# Altium project VENTUNOQ.PrjPcb (part 1 of 18)
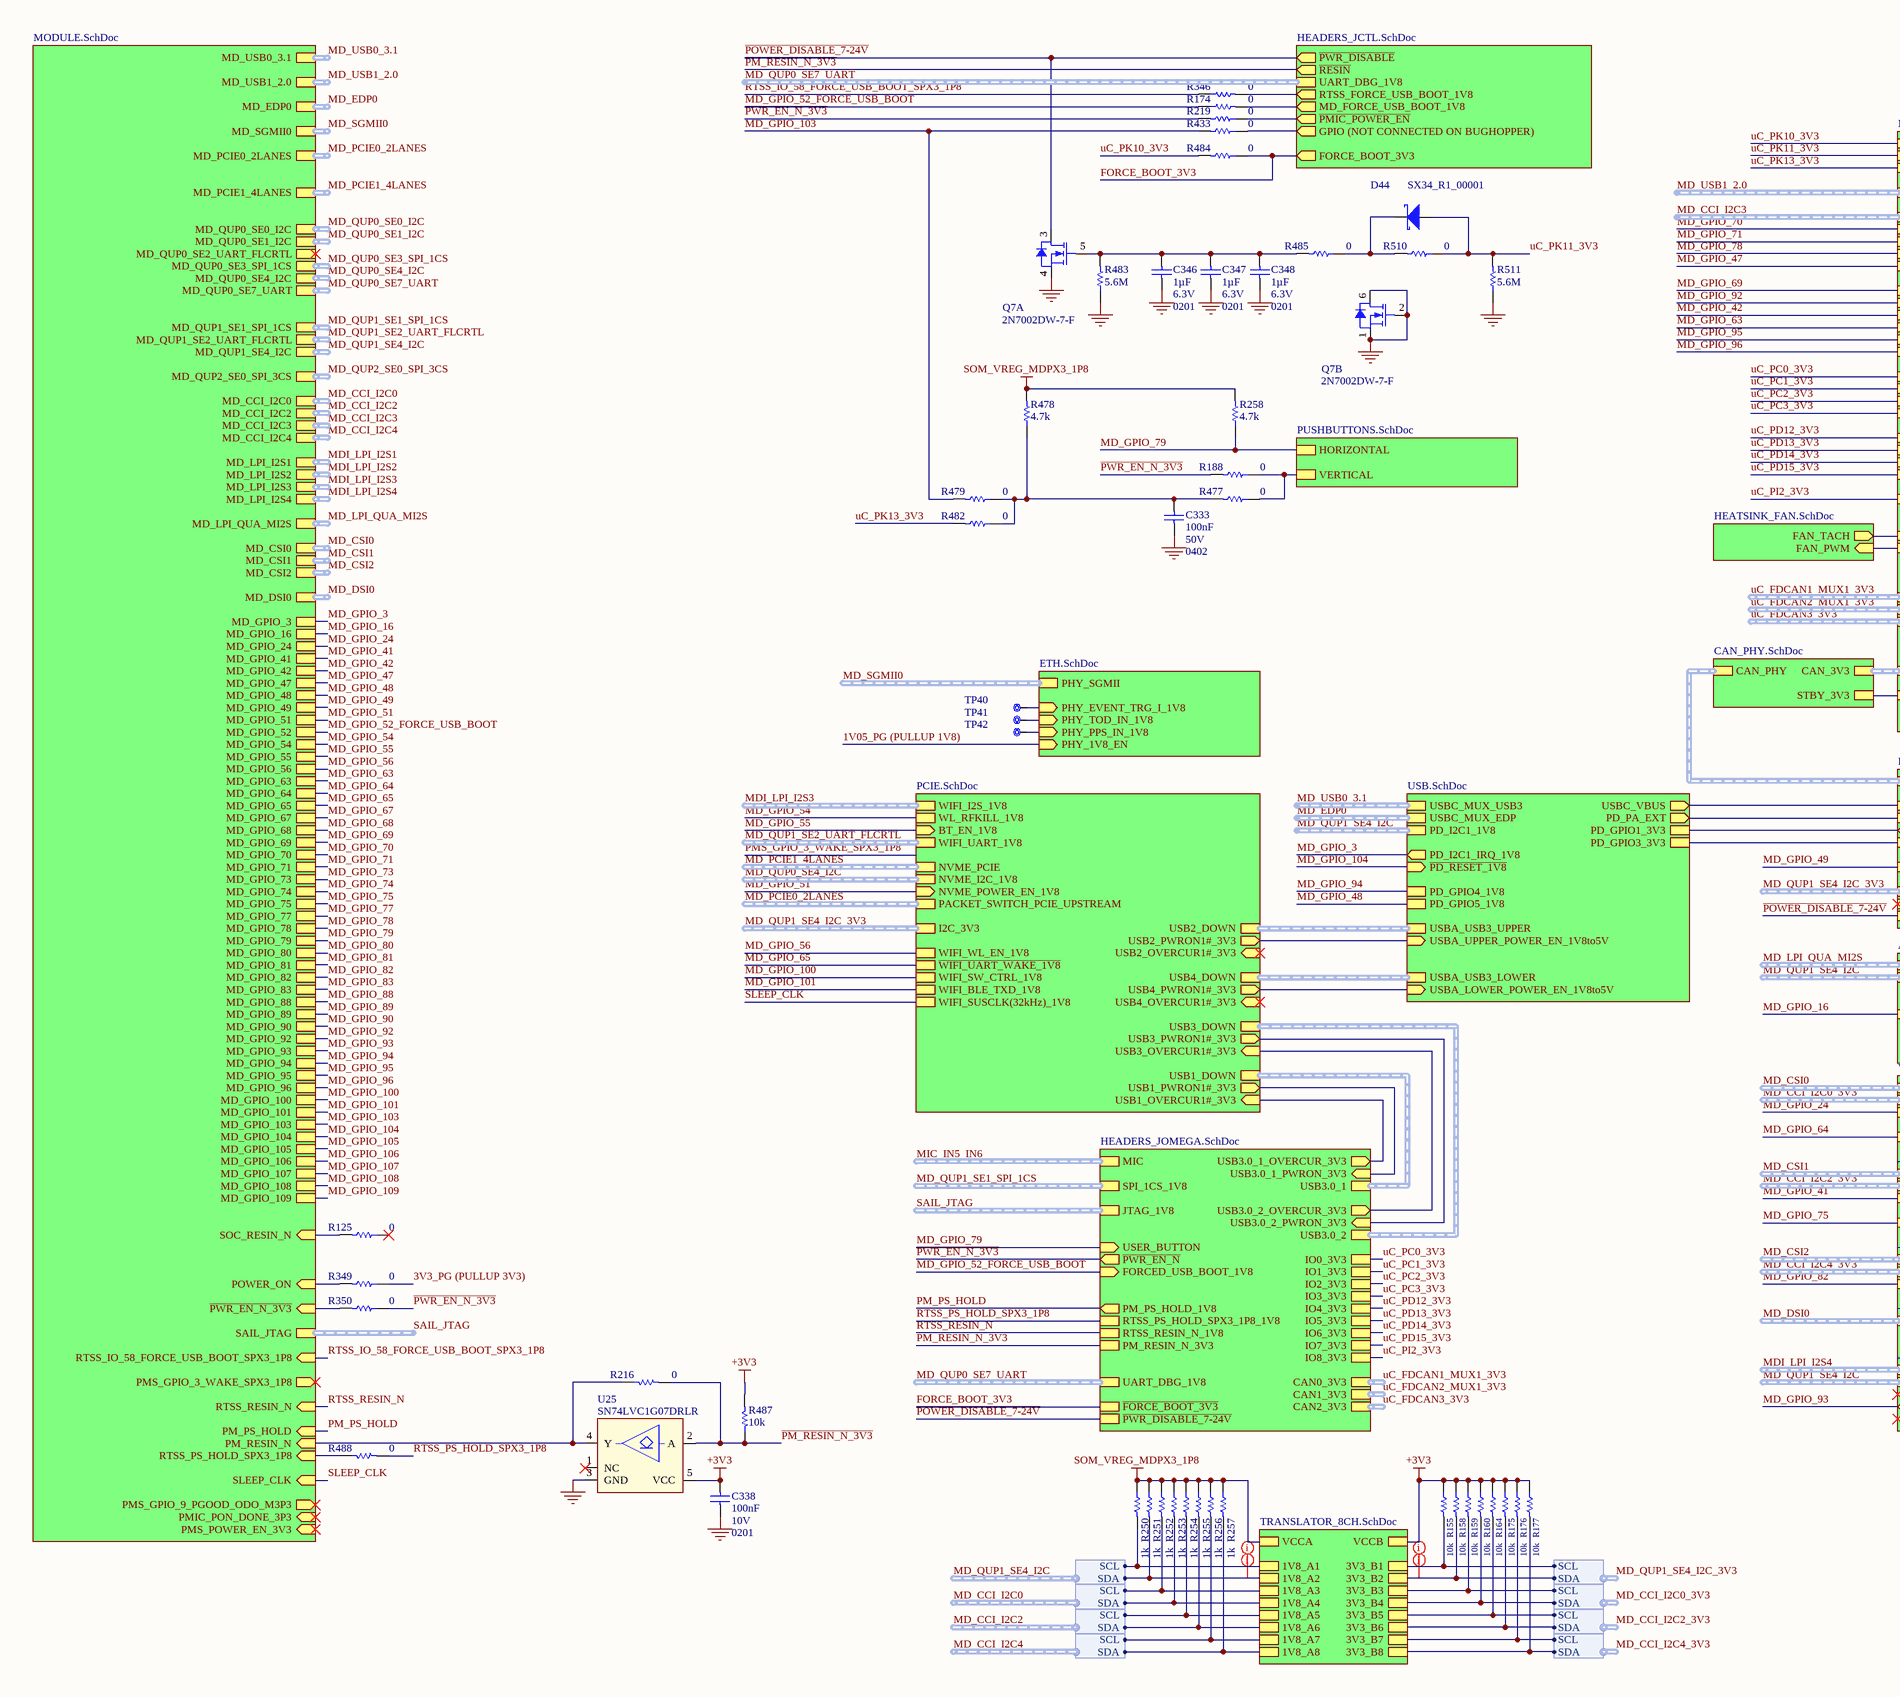
[diagram p0: TOP.SchDoc, left]
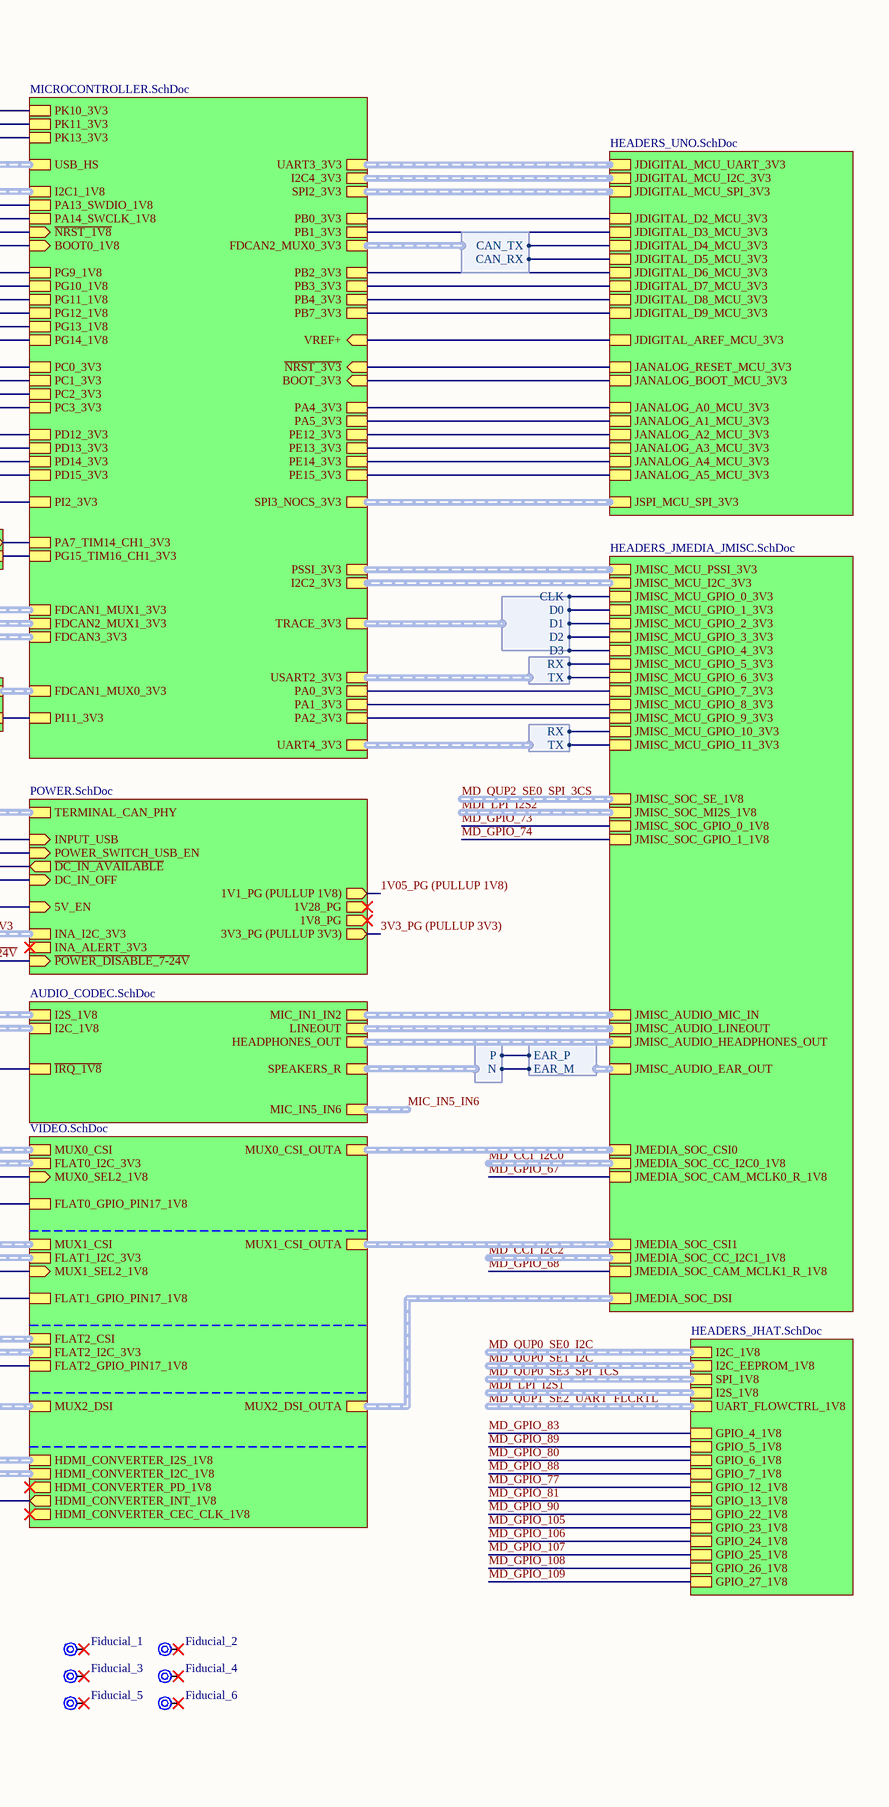
[diagram p1: TOP.SchDoc, right]
ASSEMBLY_BGA: X; ASSEMBLY_PRESSFIT: _; ASSEMBLY_SMD: X; ASSEMBLY_THT: X; BOARD_CODENAME: GERTRUDE; BOARD_INFO_AUTHOR: Silvio Navaretti; BOARD_INFO_AUTHOR_REV: Silvio Navaretti; BOARD_INFO_Er: _; BOARD_INFO_FLEX: _; BOARD_INFO_FR4: X; BOARD_INFO_FR4_HTG: _; BOARD_INFO_IPC1: _; BOARD_INFO_IPC2: X; BOARD_INFO_IPC3: _; BOARD_INFO_IPC_NA: X; BOARD_INFO_NUMBER_OF_LAYERS: 10; BOARD_INFO_PCB_SIZE: 100x160mm; BOARD_INFO_POLYMIDE: _; BOARD_INFO_RIGID: X; BOARD_INFO_RIGID/FLEX: _; BOARD_INFO_TBD: _; BOARD_INFO_THICKNESS: 2mm; DRILLS_BLIND: X; DRILLS_BURIED: X; DRILLS_COPPER_FILLING: X; DRILLS_FULL: X; DRILLS_LASER: X; DRILLS_PRESSFIT: _; DRILLS_RESIN_FILLING: _; DRILLS_SLOT: X; DRILLS_SOLDER_FILLING: _; FINISH_ADJUSTMENTS: _; FINISH_EDGE_PLATING: _; FINISH_ENIG: X; FINISH_HAL: _; FINISH_HAL_LF: _; FINISH_NI/AU: _; FINISH_SILK_BOTTOM: X; FINISH_SILK_COLOR: WHITE; FINISH_SILK_TOP: X; FINISH_SN/PB: _; FINISH_SOLDERMASK_BOTTOM: X; FINISH_SOLDERMASK_COLOR: BLUE; FINISH_SOLDERMASK_PEELABLE_BOTTOM: _; FINISH_SOLDERMASK_PEELABLE_COLOR: _; FINISH_SOLDERMASK_PEELABLE_TOP: _; FINISH_SOLDERMASK_TOP: X; FINISH_TABS: _; FINISH_TBD: _; INSULATION_MIN_INNER: 0.084mm; INSULATION_MIN_OUTER: 0.084mm; PANEL_MILLING: X; PANEL_NOT_REQUESTED: _; PANEL_NUMBER_OF_FIGURES: _; PANEL_PROVIDED: _; PANEL_REQUESTED: X; PANEL_SCORING: X; PANEL_SIZE: _; PANEL_TABS: _; SKU: ABX00181; TRACK_MIN_WIDTH_INNER: 0.084mm; TRACK_MIN_WIDTH_OUTER: 0.084mm; Version: V1.0; VIA_1: X; VIA_1_HOLE_MM: 0.1; VIA_1_PAD_MM: 0.25; VIA_2: 0.2; VIA_2_HOLE_MM: 0.4; VIA_2_PAD_MM: _; VIA_3: _; VIA_3_HOLE_MM: _; VIA_3_PAD_MM: _; VIA_4: _; VIA_4_HOLE_MM: _; VIA_4_PAD_MM: _; VIA_5: _; VIA_5_HOLE_MM: _; VIA_5_PAD_MM: _; VIA_THROUGH: X; VIA_THROUGH_HOLE_MM: 0.3; VIA_THROUGH_PAD_MM: 0.6
51 sheets, 1358 parts. Net scope: hierarchical (ports join the sheet entries above them; power ports are global).
Board file: PCB.PcbDoc
Sheets:
  TOP.SchDoc
    MODULE = MODULE.SchDoc
      MODULE_GND = MODULE_GND.SchDoc
      MODULE_PWR = MODULE_PWR.SchDoc
      MODULE_SAIL = MODULE_SAIL.SchDoc
      U_SOM_MD = MODULE_MD.SchDoc
      MODULE_SAIL_FLASH = MODULE_SAIL_FLASH.SchDoc
      MODULE_STRAPS_MD = MODULE_STRAPS_MD.SchDoc
      MODULE_STRAPS_SAIL = MODULE_STRAPS_SAIL.SchDoc
      MODULE_CONTROL = MODULE_CONTROL.SchDoc
    U_USB = USB.SchDoc
      U_USB_USBC = USB_USBC.SchDoc
      U_USB_MUX = USB_MUX.SchDoc
      U_USB_PD_CONTROLLER = USB_PD_CONTROLLER.SchDoc
        T8CH_ = TRANSLATOR_8CH.SchDoc
      U_USB_USBA = USB_USBA.SchDoc
      U_LOAD_SWITCH_5V = LOAD_SWITCH_5V.SchDoc
      U_LOAD_SWITCH_5V = LOAD_SWITCH_5V.SchDoc
    U_ETH = ETH.SchDoc
      U_ETH_PHY = ETH_PHY.SchDoc
        U_LOAD_SWITCH_5V = LOAD_SWITCH_5V.SchDoc
      U_ETH_RJ45 = ETH_RJ45.SchDoc
    U_HEADERS_UNO = HEADERS_UNO.SchDoc
    U_POWER = POWER.SchDoc
      U_POWER_SOM = POWER_DCDC_SOM.SchDoc
      U_POWER_DCDC_CARRIER = POWER_REGULATORS_CARRIER.SchDoc
      U_LOAD_SWITCH_5V = LOAD_SWITCH_5V.SchDoc
      U_LOAD_SWITCH_5V = LOAD_SWITCH_5V.SchDoc
    U_AUDIO_CODEC = AUDIO_CODEC.SchDoc
    U_HEADERS_JHAT = HEADERS_JHAT.SchDoc
      T8CH_ = TRANSLATOR_8CH.SchDoc
      T8CH_ = TRANSLATOR_8CH.SchDoc
      T8CH_ = TRANSLATOR_8CH.SchDoc
      U_TRANSLATOR_4CH = TRANSLATOR_4CH.SchDoc
    U_MIPI = VIDEO.SchDoc
      U_HDMI = HDMI.SchDoc
        U_HDMI_CONNECTOR = HDMI_CONNECTOR.SchDoc
        U_HDMI_CONVERTER = HDMI_CONVERTER.SchDoc
      U_MIPI_MUX = MIPI_MUX.SchDoc
      U_MIPI_MUX = MIPI_MUX.SchDoc
      U_MIPI_FLAT_22PIN = MIPI_FLAT_22PIN.SchDoc
      U_MIPI_FLAT_22PIN = MIPI_FLAT_22PIN.SchDoc
      U_MIPI_MUX = MIPI_MUX.SchDoc
      U_MIPI_FLAT_22PIN = MIPI_FLAT_22PIN.SchDoc
      U_TRANSLATOR_4CH = TRANSLATOR_4CH.SchDoc
    U_PUSHBUTTONS = PUSHBUTTONS.SchDoc
    U_HEADERS_JALFA_JBETA = HEADERS_JOMEGA.SchDoc
    U_MICROCONTROLLER = MICROCONTROLLER.SchDoc
      U_STM32 = STM32.SchDoc
      U_LED = LED.SchDoc
        U_LED_MATRIX = LED_MATRIX.SchDoc
        U_LED_RGB = LED_RGB.SchDoc
        U_LED_RGB = LED_RGB.SchDoc
        U_LED_RGB = LED_RGB.SchDoc
        U_LED_RGB = LED_RGB.SchDoc
      U_QWIIC = QWIIC.SchDoc
      U_ANALOG_SWITCH = ANALOG_SWITCH.SchDoc
      U_TRANSLATOR_4CH = TRANSLATOR_4CH.SchDoc
    U_HEADERS_JMEDIA_JMISC = HEADERS_JMEDIA_JMISC.SchDoc
    U_HEADERS_JCTL = HEADERS_JCTL.SchDoc
    T8CH_ = TRANSLATOR_8CH.SchDoc
    U_HEATSINK_FAN = HEATSINK_FAN.SchDoc
    U_PCIE = PCIE.SchDoc
      U_PCIE_PACKET_SWITCH = PCIE_PACKET_SWITCH.SchDoc
      U_PCIE_NVME = PCIE_NVME.SchDoc
        U_LOAD_SWITCH_5V = LOAD_SWITCH_5V.SchDoc
      U_WIFI_BLE = WIFI_BLE.SchDoc
        U_TRANSLATOR_4CH = TRANSLATOR_4CH.SchDoc
      U_PCIE_USB = PCIE_USB.SchDoc
      U_TRANSLATOR_4CH = TRANSLATOR_4CH.SchDoc
    U_CAN_PHY = CAN_PHY.SchDoc

## Sheet TOP.SchDoc: TOP
size A2; Author: Silvio Navaretti; CompanyName: ARDUINO; DrawnBy: Silvio Navaretti; Engineer: Silvio Navaretti; Organization: ARDUINO; SheetNumber: 1; SheetTotal: 51; RevAuthor: Silvio Navaretti

### Parts
C333  value 100nF  Voltage: 50V  Case Code (Imperial): 0402  [CAP-0402]  (hidden comment: GRM155R61H104KE19D)
C338  value 100nF  Voltage: 10V  Case Code (Imperial): 0201  [CAP-0201]  (hidden comment: CL03A104KP3NNNC)
C346  value 1µF  Voltage: 6.3V  Case Code (Imperial): 0201  [CAP-0201]  (hidden comment: GRM033R60J105MEA2D)
C347  value 1µF  Voltage: 6.3V  Case Code (Imperial): 0201  [CAP-0201]  (hidden comment: GRM033R60J105MEA2D)
C348  value 1µF  Voltage: 6.3V  Case Code (Imperial): 0201  [CAP-0201]  (hidden comment: GRM033R60J105MEA2D)
D44  SX34_R1_00001  [SMA DO214AC]
Fiducial_1  Fiducial mark 1mm with 2mm solder  [Fiducial mark 1mm with circle-Footprint-1]  (value not drawn)  (no BOM)
Fiducial_2  Fiducial mark 1mm with 2mm solder  [Fiducial mark 1mm with circle-Footprint-1]  (value not drawn)  (no BOM)
Fiducial_3  Fiducial mark 1mm with 2mm solder  [Fiducial mark 1mm with circle-Footprint-1]  (value not drawn)  (no BOM)
Fiducial_4  Fiducial mark 1mm with 2mm solder  [Fiducial mark 1mm with circle-Footprint-1]  (value not drawn)  (no BOM)
Fiducial_5  Fiducial mark 1mm with 2mm solder  [Fiducial mark 1mm with circle-Footprint-1]  (value not drawn)  (no BOM)
Fiducial_6  Fiducial mark 1mm with 2mm solder  [Fiducial mark 1mm with circle-Footprint-1]  (value not drawn)  (no BOM)
Q7  2N7002DW-7-F  [SOT363]  (parts A,B of 2)
R125  value 0  [RES-0201]  (hidden comment: CRCW02010000Z0ED)
R155  value 10k  [RES-0201]  (hidden comment: RC0201FR-0710KL)
R158  value 10k  [RES-0201]  (hidden comment: RC0201FR-0710KL)
R159  value 10k  [RES-0201]  (hidden comment: RC0201FR-0710KL)
R160  value 10k  [RES-0201]  (hidden comment: RC0201FR-0710KL)
R164  value 10k  [RES-0201]  (hidden comment: RC0201FR-0710KL)
R174  value 0  [RES-0201]  (hidden comment: CRCW02010000Z0ED)
R175  value 10k  [RES-0201]  (hidden comment: RC0201FR-0710KL)
R176  value 10k  [RES-0201]  (hidden comment: RC0201FR-0710KL)
R177  value 10k  [RES-0201]  (hidden comment: RC0201FR-0710KL)
R188  value 0  [RES-0201]  (hidden comment: CRCW02010000Z0ED)
R216  value 0  [RES-0201]  (hidden comment: CRCW02010000Z0ED)
R219  value 0  [RES-0201]  (hidden comment: CRCW02010000Z0ED)
R250  value 1k  [RES-0201]  (hidden comment: RC0201FR-071KL)
R251  value 1k  [RES-0201]  (hidden comment: RC0201FR-071KL)
R252  value 1k  [RES-0201]  (hidden comment: RC0201FR-071KL)
R253  value 1k  [RES-0201]  (hidden comment: RC0201FR-071KL)
R254  value 1k  [RES-0201]  (hidden comment: RC0201FR-071KL)
R255  value 1k  [RES-0201]  (hidden comment: RC0201FR-071KL)
R256  value 1k  [RES-0201]  (hidden comment: RC0201FR-071KL)
R257  value 1k  [RES-0201]  (hidden comment: RC0201FR-071KL)
R258  value 4.7k  [RES-0201]  (hidden comment: RC0201FR-074K7L)
R346  value 0  [RES-0201]  (hidden comment: CRCW02010000Z0ED)
R349  value 0  [RES-0201]  (hidden comment: CRCW02010000Z0ED)
R350  value 0  [RES-0201]  (hidden comment: CRCW02010000Z0ED)
R433  value 0  [RES-0201]  (hidden comment: CRCW02010000Z0ED)
R477  value 0  [RES-0201]  (hidden comment: CRCW02010000Z0ED)
R478  value 4.7k  [RES-0201]  (hidden comment: RC0201FR-074K7L)
R479  value 0  [RES-0201]  (hidden comment: CRCW02010000Z0ED)
R482  value 0  [RES-0201]  (hidden comment: CRCW02010000Z0ED)
R483  value 5.6M  [RES-0201]  (hidden comment: RC0201FR-075M6L)
R484  value 0  [RES-0201]  (hidden comment: CRCW02010000Z0ED)
R485  value 0  [RES-0201]  (hidden comment: CRCW02010000Z0ED)
R487  value 10k  [RES-0201]  (hidden comment: RC0201FR-0710KL)
R488  value 0  [RES-0201]  (hidden comment: CRCW02010000Z0ED)
R510  value 0  [RES-0201]  (hidden comment: CRCW02010000Z0ED)
R511  value 5.6M  [RES-0201]  (hidden comment: RC0201FR-075M6L)
TP40  Test point 1.00mm  [TP-1.00MM]  (value not drawn)  (no BOM)
TP41  Test point 1.00mm  [TP-1.00MM]  (value not drawn)  (no BOM)
TP42  Test point 1.00mm  [TP-1.00MM]  (value not drawn)  (no BOM)
U25  SN74LVC1G07DRLR  [TI DRL DRL0005A]

### Sub-sheets
MODULE = MODULE.SchDoc: MD_GPIO_3, MD_GPIO_16, MD_GPIO_24, MD_GPIO_42, MD_GPIO_47, MD_GPIO_48, MD_GPIO_54, MD_GPIO_55, MD_GPIO_63, MD_GPIO_64, MD_GPIO_65, MD_GPIO_67, MD_GPIO_68, MD_GPIO_69, MD_GPIO_70, MD_GPIO_71, MD_GPIO_73, MD_GPIO_74, MD_GPIO_75, MD_GPIO_77, MD_GPIO_78, MD_GPIO_79, MD_GPIO_80, MD_GPIO_81, MD_GPIO_83, MD_GPIO_88, MD_GPIO_89, MD_GPIO_90, MD_GPIO_92, MD_GPIO_94, MD_GPIO_95, MD_GPIO_100, MD_GPIO_101, MD_GPIO_104, MD_GPIO_105, MD_GPIO_106, MD_GPIO_107, MD_GPIO_108, MD_GPIO_109, MD_GPIO_52, MD_GPIO_56, MD_GPIO_93, MD_LPI_I2S1 (harness SOM_MD_I2S), MD_LPI_I2S4 (harness SOM_MD_I2S), MD_LPI_I2S3 (harness SOM_MD_I2S), MD_LPI_I2S2 (harness SOM_MD_I2S), MD_CSI0, MD_CSI1, MD_CSI2, MD_DSI0, MD_EDP0, MD_SGMII0, MD_USB0_3.1, MD_USB1_2.0, MD_QUP2_SE0_SPI_3CS (harness SOM_MD_SPI_3CS), MD_CCI_I2C0 (harness I2C), MD_CCI_I2C2 (harness I2C), MD_CCI_I2C3 (harness I2C), MD_CCI_I2C4 (harness I2C), MD_QUP0_SE4_I2C (harness I2C), MD_QUP0_SE3_SPI_1CS (harness SPI), MD_QUP0_SE1_I2C (harness I2C), MD_QUP0_SE7_UART (harness UART), MD_QUP0_SE0_I2C (harness I2C), MD_QUP1_SE2_UART_FLCRTL (harness SOM_MD_UART_FLCRTL), MD_QUP1_SE1_SPI_1CS (harness SPI), MD_QUP1_SE4_I2C (harness I2C), MD_GPIO_103, MD_GPIO_49, MD_GPIO_51, MD_GPIO_96, MD_GPIO_41, MD_GPIO_82, MD_PCIE1_4LANES, POWER_ON (in), MD_LPI_QUA_MI2S (harness SOM_MD_I2S_QUA), SAIL_JTAG, RTSS_IO_58_FORCE_USB_BOOT_SPX3_1P8 (in), SOC_RESIN_N (in), MD_PCIE0_2LANES, PMS_GPIO_3_WAKE_SPX3_1P8 (out), RTSS_RESIN_N (in), PM_PS_HOLD (in), PM_RESIN_N (in), RTSS_PS_HOLD_SPX3_1P8 (in), MD_QUP0_SE2_UART_FLCRTL (harness SOM_MD_UART_FLCRTL), ~{PWR_EN_N_3V3} (in), SLEEP_CLK (in), PMS_GPIO_9_PGOOD_ODO_M3P3 (out), PMIC_PON_DONE_3P3 (in), PMS_POWER_EN_3V3 (in)
T8CH_ = TRANSLATOR_8CH.SchDoc: 1V8_A1, 1V8_A2, 1V8_A3, 1V8_A4, 1V8_A5, 1V8_A6, 1V8_A7, 1V8_A8, 3V3_B1, 3V3_B2, 3V3_B3, 3V3_B4, 3V3_B5, 3V3_B6, 3V3_B7, 3V3_B8, VCCA, VCCB
U_AUDIO_CODEC = AUDIO_CODEC.SchDoc: I2C_1V8 (harness I2C), HEADPHONES_OUT (harness HEADPHONES), MIC_IN1_IN2 (harness MIC), MIC_IN5_IN6 (harness MIC), ~{IRQ_1V8}, LINEOUT (harness LINEOUT), SPEAKERS_R (harness SPEAKERS), I2S_1V8 (harness SOM_MD_I2S_QUA)
U_CAN_PHY = CAN_PHY.SchDoc: CAN_PHY (harness CAN_PHY), STBY_3V3, CAN_3V3 (harness CAN)
U_ETH = ETH.SchDoc: PHY_SGMII, PHY_EVENT_TRG_I_1V8 (in), PHY_TOD_IN_1V8 (in), PHY_PPS_IN_1V8 (in), PHY_1V8_EN (in)
U_HEADERS_JALFA_JBETA = HEADERS_JOMEGA.SchDoc: JTAG_1V8 (harness SOM_SAIL_JTAG), MIC (harness MIC), SPI_1CS_1V8 (harness SPI), USB3.0_1 (harness SOM_MD_USB0), USB3.0_1_PWRON_3V3 (in), USB3.0_1_OVERCUR_3V3 (out), USB3.0_2 (harness SOM_MD_USB0), USB3.0_2_PWRON_3V3 (in), USB3.0_2_OVERCUR_3V3 (out), CAN0_3V3 (harness CAN), CAN1_3V3 (harness CAN), CAN2_3V3 (harness CAN), USER_BUTTON (in), FORCED_USB_BOOT_1V8 (in), IO0_3V3, IO1_3V3, IO2_3V3, IO3_3V3, IO4_3V3, IO5_3V3, IO6_3V3, IO7_3V3, IO8_3V3, PM_PS_HOLD_1V8 (out), RTSS_PS_HOLD_SPX3_1P8_1V8, RTSS_RESIN_N_1V8, PM_RESIN_N_3V3, ~{PWR_EN_N} (out), UART_DBG_1V8 (harness UART), ~{FORCE_BOOT_3V3}, ~{PWR_DISABLE_7-24V}
U_HEADERS_JCTL = HEADERS_JCTL.SchDoc: UART_DBG_1V8 (harness UART), MD_FORCE_USB_BOOT_1V8 (out), RTSS_FORCE_USB_BOOT_1V8 (out), ~{PWR_DISABLE} (out), ~{PMIC_POWER_EN} (out), GPIO (NOT CONNECTED ON BUGHOPPER) (out), ~{RESIN} (out), FORCE_BOOT_3V3 (out)
U_HEADERS_JHAT = HEADERS_JHAT.SchDoc: I2C_1V8 (harness I2C), I2C_EEPROM_1V8 (harness I2C), SPI_1V8 (harness SPI), I2S_1V8 (harness SOM_MD_I2S), UART_FLOWCTRL_1V8 (harness SOM_MD_UART_FLCRTL), GPIO_4_1V8, GPIO_5_1V8, GPIO_6_1V8, GPIO_7_1V8, GPIO_13_1V8, GPIO_22_1V8, GPIO_23_1V8, GPIO_24_1V8, GPIO_25_1V8, GPIO_26_1V8, GPIO_27_1V8, GPIO_12_1V8
U_HEADERS_JMEDIA_JMISC = HEADERS_JMEDIA_JMISC.SchDoc: JMISC_MCU_PSSI_3V3 (harness PSSI), JMISC_MCU_I2C_3V3 (harness I2C), JMEDIA_SOC_CAM_MCLK0_R_1V8, JMEDIA_SOC_CAM_MCLK1_R_1V8, JMEDIA_SOC_CC_I2C1_1V8 (harness I2C), JMISC_AUDIO_EAR_OUT (harness EAT), JMISC_AUDIO_MIC_IN (harness MIC), JMISC_AUDIO_LINEOUT (harness LINEOUT), JMISC_AUDIO_HEADPHONES_OUT (harness HEADPHONES), JMISC_SOC_SE_1V8 (harness SOM_MD_SPI_3CS), JMEDIA_SOC_CSI1 (harness MIPI_4LANES), JMISC_SOC_MI2S_1V8 (harness SOM_MD_I2S), JMISC_SOC_GPIO_0_1V8, JMISC_SOC_GPIO_1_1V8, JMEDIA_SOC_DSI (harness MIPI_4LANES), JMEDIA_SOC_CSI0 (harness MIPI_4LANES), JMEDIA_SOC_CC_I2C0_1V8 (harness I2C), JMISC_MCU_GPIO_0_3V3, JMISC_MCU_GPIO_1_3V3, JMISC_MCU_GPIO_2_3V3, JMISC_MCU_GPIO_3_3V3, JMISC_MCU_GPIO_4_3V3, JMISC_MCU_GPIO_5_3V3, JMISC_MCU_GPIO_6_3V3, JMISC_MCU_GPIO_7_3V3, JMISC_MCU_GPIO_8_3V3, JMISC_MCU_GPIO_9_3V3, JMISC_MCU_GPIO_10_3V3, JMISC_MCU_GPIO_11_3V3
U_HEADERS_UNO = HEADERS_UNO.SchDoc: JDIGITAL_MCU_SPI_3V3 (harness SPI), JDIGITAL_MCU_UART_3V3 (harness UART), JDIGITAL_MCU_I2C_3V3 (harness I2C), JSPI_MCU_SPI_3V3 (harness JSPI_SPI), JDIGITAL_D2_MCU_3V3, JDIGITAL_D3_MCU_3V3, JDIGITAL_D4_MCU_3V3, JDIGITAL_D5_MCU_3V3, JDIGITAL_D6_MCU_3V3, JDIGITAL_D7_MCU_3V3, JDIGITAL_D8_MCU_3V3, JDIGITAL_D9_MCU_3V3, JANALOG_A5_MCU_3V3, JANALOG_A4_MCU_3V3, JANALOG_A3_MCU_3V3, JANALOG_A2_MCU_3V3, JANALOG_A1_MCU_3V3, JANALOG_A0_MCU_3V3, JDIGITAL_AREF_MCU_3V3, JANALOG_RESET_MCU_3V3, JANALOG_BOOT_MCU_3V3
U_HEATSINK_FAN = HEATSINK_FAN.SchDoc: FAN_TACH (out), FAN_PWM (in)
U_MICROCONTROLLER = MICROCONTROLLER.SchDoc: PG9_1V8, PG10_1V8, PG11_1V8, PG12_1V8, PG13_1V8, PG14_1V8, I2C1_1V8, ~{NRST_1V8} (in), BOOT0_1V8 (in), PA13_SWDIO_1V8, PA14_SWCLK_1V8, USB_HS, PB0_3V3, PB1_3V3, PB2_3V3, PB3_3V3, PB4_3V3, PB7_3V3, SPI2_3V3, I2C4_3V3, FDCAN2_MUX0_3V3 (harness CAN), UART3_3V3, PA4_3V3, PA5_3V3, PE12_3V3, PE13_3V3, PE14_3V3, PE15_3V3, SPI3_NOCS_3V3, BOOT_3V3 (in), ~{NRST_3V3} (in), VREF+ (in), PSSI_3V3, I2C2_3V3, PA0_3V3, PA1_3V3, PA2_3V3, PC0_3V3, PC1_3V3, PC2_3V3, PC3_3V3, PA7_TIM14_CH1_3V3, PG15_TIM16_CH1_3V3, TRACE_3V3 (harness MCU_TRACE), USART2_3V3 (harness UART), FDCAN1_MUX1_3V3, FDCAN2_MUX1_3V3, FDCAN3_3V3, PD12_3V3, PD13_3V3, PD14_3V3, PD15_3V3, PI2_3V3, PI11_3V3, UART4_3V3 (harness UART), FDCAN1_MUX0_3V3, PK13_3V3, PK10_3V3, PK11_3V3
U_MIPI = VIDEO.SchDoc: MUX0_CSI, MUX1_CSI, FLAT2_CSI, MUX2_DSI, MUX0_CSI_OUTA, MUX1_CSI_OUTA, HDMI_CONVERTER_PD_1V8 (out), HDMI_CONVERTER_INT_1V8 (out), HDMI_CONVERTER_CEC_CLK_1V8 (out), MUX2_DSI_OUTA, FLAT0_GPIO_PIN17_1V8, FLAT1_GPIO_PIN17_1V8, FLAT2_GPIO_PIN17_1V8, FLAT0_I2C_3V3, FLAT1_I2C_3V3, FLAT2_I2C_3V3, MUX0_SEL2_1V8 (in), MUX1_SEL2_1V8 (in), HDMI_CONVERTER_I2C_1V8 (harness I2C), HDMI_CONVERTER_I2S_1V8 (harness I2C)
U_PCIE = PCIE.SchDoc: USB1_DOWN, USB1_PWRON1#_3V3 (out), USB1_OVERCUR1#_3V3 (in), USB2_DOWN, USB2_PWRON1#_3V3 (out), USB2_OVERCUR1#_3V3 (in), USB3_PWRON1#_3V3 (out), USB3_OVERCUR1#_3V3 (in), WIFI_I2S_1V8, I2C_3V3, NVME_I2C_1V8, NVME_PCIE, NVME_POWER_EN_1V8 (in), WIFI_UART_1V8, USB4_DOWN, USB4_PWRON1#_3V3 (out), USB4_OVERCUR1#_3V3 (in), PACKET_SWITCH_PCIE_UPSTREAM (harness SOM_MD_PCIE0), USB3_DOWN (harness SOM_MD_USB0), WL_RFKILL_1V8, ~{WIFI_UART_WAKE_1V8}, BT_EN_1V8 (in), WIFI_SW_CTRL_1V8, WIFI_WL_EN_1V8, WIFI_BLE_TXD_1V8, WIFI_SUSCLK(32kHz)_1V8
U_POWER = POWER.SchDoc: 5V_EN (in), INPUT_USB (in), POWER_SWITCH_USB_EN (in), 1V28_PG (out), 1V8_PG (out), TERMINAL_CAN_PHY (harness CAN_PHY), 3V3_PG (PULLUP 3V3) (out), INA_I2C_3V3 (harness I2C), INA_ALERT_3V3, DC_IN_OFF (in), 1V1_PG (PULLUP 1V8) (out), ~{DC_IN_AVAILABLE} (out), ~{POWER_DISABLE_7-24V} (in)
U_PUSHBUTTONS = PUSHBUTTONS.SchDoc: VERTICAL, HORIZONTAL
U_USB = USB.SchDoc: USBC_MUX_USB3 (harness SOM_MD_USB0), USBC_MUX_EDP (harness SOM_MD_EDP0), USBA_USB3_UPPER (harness SOM_MD_EDP0), USBA_USB3_LOWER (harness SOM_MD_EDP0), USBC_VBUS (out), USBA_UPPER_POWER_EN_1V8to5V (in), USBA_LOWER_POWER_EN_1V8to5V (in), PD_I2C1_IRQ_1V8 (out), ~{PD_RESET_1V8} (in), PD_GPIO4_1V8, PD_GPIO5_1V8, PD_I2C1_1V8 (harness I2C), PD_GPIO1_3V3, PD_GPIO3_3V3, PD_PA_EXT (out)

### Harnesses
CAN: CAN_TX, CAN_RX
EAT: EAR_P, EAR_M
SPEAKERS: N, P
I2C: SDA, SCL
UART: TX, RX
MCU_TRACE: CLK, D0, D1, D2, D3

### Nets
+3V3: C338.2 R155.1 R158.1 R159.1 R160.1 R164.1 R175.1 R176.1 R177.1 R487.2 U25.5(VCC) ; sheet T8CH_/VCCB
GND: C333.2 C338.1 C346.1 C347.1 C348.1 Q7.1(S) Q7.2(G) Q7.4(S) Q7.6(D) R483.1 R511.1 U25.3(GND)
SOM_VREG_MDPX3_1P8: R250.1 R251.1 R252.1 R253.1 R254.1 R255.1 R256.1 R257.1 R258.2 R478.2 ; sheet T8CH_/VCCA
1V05_PG (PULLUP 1V8): sheet U_ETH/PHY_1V8_EN, sheet U_POWER/1V1_PG (PULLUP 1V8)
3V3_PG (PULLUP 3V3): R349.1 ; sheet U_POWER/3V3_PG (PULLUP 3V3)
BOOT0: sheet U_HEADERS_UNO/JANALOG_BOOT_MCU_3V3, sheet U_MICROCONTROLLER/BOOT_3V3
FORCE_BOOT_3V3: R484.1 ; sheet U_HEADERS_JALFA_JBETA/~{FORCE_BOOT_3V3}, sheet U_HEADERS_JCTL/FORCE_BOOT_3V3
MD_CCI_I2C0.SCL: R252.2 ; sheet T8CH_/1V8_A3, sheet MODULE/MD_CCI_I2C0.SCL
MD_CCI_I2C0.SDA: R253.2 ; sheet T8CH_/1V8_A4, sheet MODULE/MD_CCI_I2C0.SDA
MD_CCI_I2C0_3V3.SCL: R159.2 ; sheet T8CH_/3V3_B3, sheet U_MIPI/FLAT0_I2C_3V3.SCL
MD_CCI_I2C0_3V3.SDA: R160.2 ; sheet T8CH_/3V3_B4, sheet U_MIPI/FLAT0_I2C_3V3.SDA
MD_CCI_I2C2.SCL: R254.2 ; sheet T8CH_/1V8_A5, sheet MODULE/MD_CCI_I2C2.SCL
MD_CCI_I2C2.SDA: R255.2 ; sheet T8CH_/1V8_A6, sheet MODULE/MD_CCI_I2C2.SDA
MD_CCI_I2C2_3V3.SCL: R164.2 ; sheet T8CH_/3V3_B5, sheet U_MIPI/FLAT1_I2C_3V3.SCL
MD_CCI_I2C2_3V3.SDA: R175.2 ; sheet T8CH_/3V3_B6, sheet U_MIPI/FLAT1_I2C_3V3.SDA
MD_CCI_I2C4.SCL: R256.2 ; sheet T8CH_/1V8_A7, sheet MODULE/MD_CCI_I2C4.SCL
MD_CCI_I2C4.SDA: R257.2 ; sheet T8CH_/1V8_A8, sheet MODULE/MD_CCI_I2C4.SDA
MD_CCI_I2C4_3V3.SCL: R176.2 ; sheet T8CH_/3V3_B7, sheet U_MIPI/FLAT2_I2C_3V3.SCL
MD_CCI_I2C4_3V3.SDA: R177.2 ; sheet T8CH_/3V3_B8, sheet U_MIPI/FLAT2_I2C_3V3.SDA
MD_GPIO_3: sheet MODULE/MD_GPIO_3, sheet U_USB/PD_I2C1_IRQ_1V8
MD_GPIO_16: sheet MODULE/MD_GPIO_16, sheet U_AUDIO_CODEC/~{IRQ_1V8}
MD_GPIO_24: sheet MODULE/MD_GPIO_24, sheet U_MIPI/MUX0_SEL2_1V8
MD_GPIO_41: sheet MODULE/MD_GPIO_41, sheet U_MIPI/MUX1_SEL2_1V8
MD_GPIO_42: sheet MODULE/MD_GPIO_42, sheet U_MICROCONTROLLER/PG11_1V8
MD_GPIO_45: R251.2 ; sheet T8CH_/1V8_A2, sheet MODULE/MD_QUP1_SE4_I2C.SDA
MD_GPIO_46: R250.2 ; sheet T8CH_/1V8_A1, sheet MODULE/MD_QUP1_SE4_I2C.SCL
MD_GPIO_47: sheet MODULE/MD_GPIO_47, sheet U_MICROCONTROLLER/BOOT0_1V8
MD_GPIO_48: sheet MODULE/MD_GPIO_48, sheet U_USB/PD_GPIO5_1V8
MD_GPIO_49: sheet MODULE/MD_GPIO_49, sheet U_POWER/5V_EN
MD_GPIO_51: sheet MODULE/MD_GPIO_51, sheet U_PCIE/NVME_POWER_EN_1V8
MD_GPIO_52_FORCE_USB_BOOT: R174.1 ; sheet MODULE/MD_GPIO_52, sheet U_HEADERS_JALFA_JBETA/FORCED_USB_BOOT_1V8  [project net MD_GPIO_52]
MD_GPIO_54: sheet MODULE/MD_GPIO_54, sheet U_PCIE/WL_RFKILL_1V8
MD_GPIO_55: sheet MODULE/MD_GPIO_55, sheet U_PCIE/BT_EN_1V8
MD_GPIO_56: sheet MODULE/MD_GPIO_56, sheet U_PCIE/WIFI_WL_EN_1V8
MD_GPIO_63: sheet MODULE/MD_GPIO_63, sheet U_MICROCONTROLLER/PG12_1V8
MD_GPIO_64: sheet MODULE/MD_GPIO_64, sheet U_MIPI/FLAT0_GPIO_PIN17_1V8
MD_GPIO_65: sheet MODULE/MD_GPIO_65, sheet U_PCIE/~{WIFI_UART_WAKE_1V8}
MD_GPIO_67: sheet MODULE/MD_GPIO_67, sheet U_HEADERS_JMEDIA_JMISC/JMEDIA_SOC_CAM_MCLK0_R_1V8
MD_GPIO_68: sheet MODULE/MD_GPIO_68, sheet U_HEADERS_JMEDIA_JMISC/JMEDIA_SOC_CAM_MCLK1_R_1V8
MD_GPIO_69: sheet MODULE/MD_GPIO_69, sheet U_MICROCONTROLLER/PG9_1V8
MD_GPIO_70: sheet MODULE/MD_GPIO_70, sheet U_MICROCONTROLLER/PA13_SWDIO_1V8
MD_GPIO_71: sheet MODULE/MD_GPIO_71, sheet U_MICROCONTROLLER/PA14_SWCLK_1V8
MD_GPIO_73: sheet MODULE/MD_GPIO_73, sheet U_HEADERS_JMEDIA_JMISC/JMISC_SOC_GPIO_0_1V8
MD_GPIO_74: sheet MODULE/MD_GPIO_74, sheet U_HEADERS_JMEDIA_JMISC/JMISC_SOC_GPIO_1_1V8
MD_GPIO_75: sheet MODULE/MD_GPIO_75, sheet U_MIPI/FLAT1_GPIO_PIN17_1V8
MD_GPIO_77: sheet MODULE/MD_GPIO_77, sheet U_HEADERS_JHAT/GPIO_12_1V8
MD_GPIO_78: sheet MODULE/MD_GPIO_78, sheet U_MICROCONTROLLER/~{NRST_1V8}
MD_GPIO_79: R258.1 ; sheet MODULE/MD_GPIO_79, sheet U_PUSHBUTTONS/HORIZONTAL, sheet U_HEADERS_JALFA_JBETA/USER_BUTTON
MD_GPIO_80: sheet MODULE/MD_GPIO_80, sheet U_HEADERS_JHAT/GPIO_6_1V8
MD_GPIO_81: sheet MODULE/MD_GPIO_81, sheet U_HEADERS_JHAT/GPIO_13_1V8
MD_GPIO_82: sheet MODULE/MD_GPIO_82, sheet U_MIPI/FLAT2_GPIO_PIN17_1V8
MD_GPIO_83: sheet MODULE/MD_GPIO_83, sheet U_HEADERS_JHAT/GPIO_4_1V8
MD_GPIO_88: sheet MODULE/MD_GPIO_88, sheet U_HEADERS_JHAT/GPIO_7_1V8
MD_GPIO_89: sheet MODULE/MD_GPIO_89, sheet U_HEADERS_JHAT/GPIO_5_1V8
MD_GPIO_90: sheet MODULE/MD_GPIO_90, sheet U_HEADERS_JHAT/GPIO_22_1V8
MD_GPIO_92: sheet MODULE/MD_GPIO_92, sheet U_MICROCONTROLLER/PG10_1V8
MD_GPIO_93: sheet MODULE/MD_GPIO_93, sheet U_MIPI/HDMI_CONVERTER_INT_1V8
MD_GPIO_94: sheet MODULE/MD_GPIO_94, sheet U_USB/PD_GPIO4_1V8
MD_GPIO_95: sheet MODULE/MD_GPIO_95, sheet U_MICROCONTROLLER/PG13_1V8
MD_GPIO_96: sheet MODULE/MD_GPIO_96, sheet U_MICROCONTROLLER/PG14_1V8
MD_GPIO_100: sheet MODULE/MD_GPIO_100, sheet U_PCIE/WIFI_SW_CTRL_1V8
MD_GPIO_101: sheet MODULE/MD_GPIO_101, sheet U_PCIE/WIFI_BLE_TXD_1V8
MD_GPIO_103: R433.2 R479.2 ; sheet MODULE/MD_GPIO_103
MD_GPIO_104: sheet MODULE/MD_GPIO_104, sheet U_USB/~{PD_RESET_1V8}
MD_GPIO_105: sheet MODULE/MD_GPIO_105, sheet U_HEADERS_JHAT/GPIO_23_1V8
MD_GPIO_106: sheet MODULE/MD_GPIO_106, sheet U_HEADERS_JHAT/GPIO_24_1V8
MD_GPIO_107: sheet MODULE/MD_GPIO_107, sheet U_HEADERS_JHAT/GPIO_25_1V8
MD_GPIO_108: sheet MODULE/MD_GPIO_108, sheet U_HEADERS_JHAT/GPIO_26_1V8
MD_GPIO_109: sheet MODULE/MD_GPIO_109, sheet U_HEADERS_JHAT/GPIO_27_1V8
MD_QUP1_SE4_I2C_3V3.SCL: R155.2 ; sheet T8CH_/3V3_B1, sheet U_POWER/INA_I2C_3V3.SCL
MD_QUP1_SE4_I2C_3V3.SDA: R158.2 ; sheet T8CH_/3V3_B2, sheet U_POWER/INA_I2C_3V3.SDA
NRST: sheet U_HEADERS_UNO/JANALOG_RESET_MCU_3V3, sheet U_MICROCONTROLLER/~{NRST_3V3}
~{PM_RESIN_N_3V3}: R216.2 R487.1 U25.2(A) ; sheet U_HEADERS_JALFA_JBETA/PM_RESIN_N_3V3, sheet U_HEADERS_JCTL/~{RESIN}
~{POWER_DISABLE_7-24V}: Q7.3(D) ; sheet U_POWER/~{POWER_DISABLE_7-24V}, sheet U_HEADERS_JALFA_JBETA/~{PWR_DISABLE_7-24V}, sheet U_HEADERS_JCTL/~{PWR_DISABLE}
~{PWR_EN_N_3V3}: R188.2 R219.2 R350.1 ; sheet U_HEADERS_JALFA_JBETA/~{PWR_EN_N}
PA0: sheet U_MICROCONTROLLER/PA0_3V3, sheet U_HEADERS_JMEDIA_JMISC/JMISC_MCU_GPIO_7_3V3
PA1: sheet U_MICROCONTROLLER/PA1_3V3, sheet U_HEADERS_JMEDIA_JMISC/JMISC_MCU_GPIO_8_3V3
PA2: sheet U_MICROCONTROLLER/PA2_3V3, sheet U_HEADERS_JMEDIA_JMISC/JMISC_MCU_GPIO_9_3V3
PA4: sheet U_HEADERS_UNO/JANALOG_A0_MCU_3V3, sheet U_MICROCONTROLLER/PA4_3V3
PA5: sheet U_HEADERS_UNO/JANALOG_A1_MCU_3V3, sheet U_MICROCONTROLLER/PA5_3V3
PA7: sheet U_MICROCONTROLLER/PA7_TIM14_CH1_3V3, sheet U_HEATSINK_FAN/FAN_TACH
PA11: sheet U_HEADERS_JMEDIA_JMISC/JMISC_MCU_GPIO_10_3V3, sheet U_MICROCONTROLLER/UART4_3V3.RX
PA12: sheet U_HEADERS_JMEDIA_JMISC/JMISC_MCU_GPIO_11_3V3, sheet U_MICROCONTROLLER/UART4_3V3.TX
PA_VBUS: sheet U_USB/USBC_VBUS, sheet U_POWER/INPUT_USB
PB0: sheet U_HEADERS_UNO/JDIGITAL_D2_MCU_3V3, sheet U_MICROCONTROLLER/PB0_3V3
PB1: sheet U_HEADERS_UNO/JDIGITAL_D3_MCU_3V3, sheet U_MICROCONTROLLER/PB1_3V3
PB2: sheet U_HEADERS_UNO/JDIGITAL_D6_MCU_3V3, sheet U_MICROCONTROLLER/PB2_3V3
PB3: sheet U_HEADERS_UNO/JDIGITAL_D7_MCU_3V3, sheet U_MICROCONTROLLER/PB3_3V3
PB4: sheet U_HEADERS_UNO/JDIGITAL_D8_MCU_3V3, sheet U_MICROCONTROLLER/PB4_3V3
PB5: sheet U_HEADERS_UNO/JDIGITAL_D5_MCU_3V3, sheet U_MICROCONTROLLER/FDCAN2_MUX0_3V3.CAN_RX
PB6: sheet U_HEADERS_UNO/JDIGITAL_D4_MCU_3V3, sheet U_MICROCONTROLLER/FDCAN2_MUX0_3V3.CAN_TX
PB7: sheet U_HEADERS_UNO/JDIGITAL_D9_MCU_3V3, sheet U_MICROCONTROLLER/PB7_3V3
PE2: sheet U_HEADERS_JMEDIA_JMISC/JMISC_MCU_GPIO_0_3V3, sheet U_MICROCONTROLLER/TRACE_3V3.CLK
PE3: sheet U_HEADERS_JMEDIA_JMISC/JMISC_MCU_GPIO_1_3V3, sheet U_MICROCONTROLLER/TRACE_3V3.D0
PE4: sheet U_HEADERS_JMEDIA_JMISC/JMISC_MCU_GPIO_2_3V3, sheet U_MICROCONTROLLER/TRACE_3V3.D1
PE5: sheet U_HEADERS_JMEDIA_JMISC/JMISC_MCU_GPIO_3_3V3, sheet U_MICROCONTROLLER/TRACE_3V3.D2
PE6: sheet U_HEADERS_JMEDIA_JMISC/JMISC_MCU_GPIO_4_3V3, sheet U_MICROCONTROLLER/TRACE_3V3.D3
PE7: sheet U_HEADERS_JMEDIA_JMISC/JMISC_MCU_GPIO_5_3V3, sheet U_MICROCONTROLLER/USART2_3V3.RX
PE8: sheet U_HEADERS_JMEDIA_JMISC/JMISC_MCU_GPIO_6_3V3, sheet U_MICROCONTROLLER/USART2_3V3.TX
PE12: sheet U_HEADERS_UNO/JANALOG_A2_MCU_3V3, sheet U_MICROCONTROLLER/PE12_3V3
PE13: sheet U_HEADERS_UNO/JANALOG_A3_MCU_3V3, sheet U_MICROCONTROLLER/PE13_3V3
PE14: sheet U_HEADERS_UNO/JANALOG_A4_MCU_3V3, sheet U_MICROCONTROLLER/PE14_3V3
PE15: sheet U_HEADERS_UNO/JANALOG_A5_MCU_3V3, sheet U_MICROCONTROLLER/PE15_3V3
PG15: sheet U_MICROCONTROLLER/PG15_TIM16_CH1_3V3, sheet U_HEATSINK_FAN/FAN_PWM
PI11: sheet U_MICROCONTROLLER/PI11_3V3, sheet U_CAN_PHY/STBY_3V3
PM_PS_HOLD: sheet MODULE/PM_PS_HOLD, sheet U_HEADERS_JALFA_JBETA/PM_PS_HOLD_1V8
RTSS_IO_58_FORCE_USB_BOOT_SPX3_1P8: R346.1 ; sheet MODULE/RTSS_IO_58_FORCE_USB_BOOT_SPX3_1P8
RTSS_PS_HOLD_SPX3_1P8: R488.2 ; sheet U_HEADERS_JALFA_JBETA/RTSS_PS_HOLD_SPX3_1P8_1V8
RTSS_RESIN_N: sheet MODULE/RTSS_RESIN_N, sheet U_HEADERS_JALFA_JBETA/RTSS_RESIN_N_1V8
SLEEP_CLK: sheet MODULE/SLEEP_CLK, sheet U_PCIE/WIFI_SUSCLK(32kHz)_1V8
uC_PC0_3V3: sheet U_HEADERS_JALFA_JBETA/IO0_3V3, sheet U_MICROCONTROLLER/PC0_3V3  [project net PC0]
uC_PC1_3V3: sheet U_HEADERS_JALFA_JBETA/IO1_3V3, sheet U_MICROCONTROLLER/PC1_3V3  [project net PC1]
uC_PC2_3V3: sheet U_HEADERS_JALFA_JBETA/IO2_3V3, sheet U_MICROCONTROLLER/PC2_3V3  [project net PC2]
uC_PC3_3V3: sheet U_HEADERS_JALFA_JBETA/IO3_3V3, sheet U_MICROCONTROLLER/PC3_3V3  [project net PC3]
uC_PD12_3V3: sheet U_HEADERS_JALFA_JBETA/IO4_3V3, sheet U_MICROCONTROLLER/PD12_3V3  [project net PD12]
uC_PD13_3V3: sheet U_HEADERS_JALFA_JBETA/IO5_3V3, sheet U_MICROCONTROLLER/PD13_3V3  [project net PD13]
uC_PD14_3V3: sheet U_HEADERS_JALFA_JBETA/IO6_3V3, sheet U_MICROCONTROLLER/PD14_3V3  [project net PD14]
uC_PD15_3V3: sheet U_HEADERS_JALFA_JBETA/IO7_3V3, sheet U_MICROCONTROLLER/PD15_3V3  [project net PD15]
uC_PI2_3V3: sheet U_HEADERS_JALFA_JBETA/IO8_3V3, sheet U_MICROCONTROLLER/PI2_3V3  [project net PI2]
uC_PK10_3V3: R484.2 ; sheet U_MICROCONTROLLER/PK10_3V3  [project net PK10]
uC_PK11_3V3: D44.A R510.1 R511.2 ; sheet U_MICROCONTROLLER/PK11_3V3  [project net PK11]
uC_PK13_3V3: R482.2 ; sheet U_MICROCONTROLLER/PK13_3V3  [project net PK13]
NetC107_2: sheet U_HEADERS_UNO/JDIGITAL_AREF_MCU_3V3, sheet U_MICROCONTROLLER/VREF+
NetC333_1: C333.1 R477.2 R478.1 R479.1 R482.1
NetC346_2: C346.2 C347.2 C348.2 Q7.5(G) R483.2 R485.2
NetD44_C: D44.C R485.1 R510.2
NetD61_2: R219.1 ; sheet U_HEADERS_JCTL/~{PMIC_POWER_EN}
NetD62_2: R433.1 ; sheet U_HEADERS_JCTL/GPIO (NOT CONNECTED ON BUGHOPPER)
NetD103_1: sheet U_HEADERS_JMEDIA_JMISC/JMISC_AUDIO_EAR_OUT.EAR_P, sheet U_AUDIO_CODEC/SPEAKERS_R.P
NetD103_2: sheet U_HEADERS_JMEDIA_JMISC/JMISC_AUDIO_EAR_OUT.EAR_M, sheet U_AUDIO_CODEC/SPEAKERS_R.N
NetJOMEGA_54: sheet U_HEADERS_JALFA_JBETA/USB3.0_1_PWRON_3V3, sheet U_PCIE/USB1_PWRON1#_3V3
NetJOMEGA_56: sheet U_HEADERS_JALFA_JBETA/USB3.0_1_OVERCUR_3V3, sheet U_PCIE/USB1_OVERCUR1#_3V3
NetJOMEGA_58: sheet U_HEADERS_JALFA_JBETA/USB3.0_2_PWRON_3V3, sheet U_PCIE/USB3_PWRON1#_3V3
NetJOMEGA_60: sheet U_HEADERS_JALFA_JBETA/USB3.0_2_OVERCUR_3V3, sheet U_PCIE/USB3_OVERCUR1#_3V3
NetMODULE1_A6: R216.1 U25.4(Y) ; sheet MODULE/PM_RESIN_N
NetMODULE1_BB43: R488.1 ; sheet MODULE/RTSS_PS_HOLD_SPX3_1P8
NetMODULE1_D28: R125.2 ; sheet MODULE/SOC_RESIN_N
NetPB1_3: R188.1 R477.1 ; sheet U_PUSHBUTTONS/VERTICAL
NetQ3_2: sheet U_USB/PD_GPIO3_3V3, sheet U_POWER/DC_IN_OFF
NetQ3_3: sheet U_USB/PD_GPIO1_3V3, sheet U_POWER/~{DC_IN_AVAILABLE}
NetQ4_3: R174.2 ; sheet U_HEADERS_JCTL/MD_FORCE_USB_BOOT_1V8
NetQ4_6: R346.2 ; sheet U_HEADERS_JCTL/RTSS_FORCE_USB_BOOT_1V8
NetR154_2: sheet U_USB/USBA_LOWER_POWER_EN_1V8to5V, sheet U_PCIE/USB4_PWRON1#_3V3
NetR182_2: sheet U_USB/USBA_UPPER_POWER_EN_1V8to5V, sheet U_PCIE/USB2_PWRON1#_3V3
NetR215_1: sheet U_USB/PD_PA_EXT, sheet U_POWER/POWER_SWITCH_USB_EN
NetR349_2: R349.2 ; sheet MODULE/POWER_ON
NetR350_2: R350.2 ; sheet MODULE/~{PWR_EN_N_3V3}
NetTP40_X: TP40.X ; sheet U_ETH/PHY_EVENT_TRG_I_1V8
NetTP41_X: TP41.X ; sheet U_ETH/PHY_TOD_IN_1V8
NetTP42_X: TP42.X ; sheet U_ETH/PHY_PPS_IN_1V8

Not connected (* = marked no-connect by the designer): Fiducial_1 1*; Fiducial_2 1*; Fiducial_3 1*; Fiducial_4 1*; Fiducial_5 1*; Fiducial_6 1*; R125 1*; U25 1(NC)*

### Buses and harness runs
harness MD_CCI_I2C0 = sheet MODULE/MD_CCI_I2C0
harness MD_CCI_I2C0 = sheet U_HEADERS_JMEDIA_JMISC/JMEDIA_SOC_CC_I2C0_1V8
harness MD_CCI_I2C0_3V3 = sheet U_MIPI/FLAT0_I2C_3V3
harness MD_CCI_I2C2 = sheet MODULE/MD_CCI_I2C2
harness MD_CCI_I2C2 = sheet U_HEADERS_JMEDIA_JMISC/JMEDIA_SOC_CC_I2C1_1V8
harness MD_CCI_I2C2_3V3 = sheet U_MIPI/FLAT1_I2C_3V3
harness MD_CCI_I2C3 = sheet MODULE/MD_CCI_I2C3
harness MD_CCI_I2C3 = sheet U_MICROCONTROLLER/I2C1_1V8
harness MD_CCI_I2C4 = sheet MODULE/MD_CCI_I2C4
harness MD_CCI_I2C4_3V3 = sheet U_MIPI/FLAT2_I2C_3V3
harness MD_CSI0 = sheet MODULE/MD_CSI0
harness MD_CSI0 = sheet U_MIPI/MUX0_CSI
harness MD_CSI1 = sheet MODULE/MD_CSI1
harness MD_CSI1 = sheet U_MIPI/MUX1_CSI
harness MD_CSI2 = sheet MODULE/MD_CSI2
harness MD_CSI2 = sheet U_MIPI/FLAT2_CSI
harness MD_DSI0 = sheet MODULE/MD_DSI0
harness MD_DSI0 = sheet U_MIPI/MUX2_DSI
harness MD_EDP0 = sheet MODULE/MD_EDP0
harness MD_EDP0 = sheet U_USB/USBC_MUX_EDP
harness MD_LPI_QUA_MI2S = sheet MODULE/MD_LPI_QUA_MI2S
harness MD_LPI_QUA_MI2S = sheet U_AUDIO_CODEC/I2S_1V8
harness MD_PCIE0_2LANES = sheet MODULE/MD_PCIE0_2LANES
harness MD_PCIE0_2LANES = sheet U_PCIE/PACKET_SWITCH_PCIE_UPSTREAM
harness MD_PCIE1_4LANES = sheet MODULE/MD_PCIE1_4LANES
harness MD_PCIE1_4LANES = sheet U_PCIE/NVME_PCIE
harness MD_QUP0_SE0_I2C = sheet MODULE/MD_QUP0_SE0_I2C
harness MD_QUP0_SE0_I2C = sheet U_HEADERS_JHAT/I2C_1V8
harness MD_QUP0_SE1_I2C = sheet MODULE/MD_QUP0_SE1_I2C
harness MD_QUP0_SE1_I2C = sheet U_HEADERS_JHAT/I2C_EEPROM_1V8
harness MD_QUP0_SE3_SPI_1CS = sheet MODULE/MD_QUP0_SE3_SPI_1CS
harness MD_QUP0_SE3_SPI_1CS = sheet U_HEADERS_JHAT/SPI_1V8
harness MD_QUP0_SE4_I2C = sheet MODULE/MD_QUP0_SE4_I2C
harness MD_QUP0_SE4_I2C = sheet U_PCIE/NVME_I2C_1V8
harness MD_QUP0_SE7_UART = sheet MODULE/MD_QUP0_SE7_UART
harness MD_QUP0_SE7_UART = sheet U_HEADERS_JALFA_JBETA/UART_DBG_1V8
harness MD_QUP0_SE7_UART = sheet U_HEADERS_JCTL/UART_DBG_1V8
harness MD_QUP1_SE1_SPI_1CS = sheet MODULE/MD_QUP1_SE1_SPI_1CS
harness MD_QUP1_SE1_SPI_1CS = sheet U_HEADERS_JALFA_JBETA/SPI_1CS_1V8
harness MD_QUP1_SE2_UART_FLCRTL = sheet MODULE/MD_QUP1_SE2_UART_FLCRTL
harness MD_QUP1_SE2_UART_FLCRTL = sheet U_HEADERS_JHAT/UART_FLOWCTRL_1V8
harness MD_QUP1_SE2_UART_FLCRTL = sheet U_PCIE/WIFI_UART_1V8
harness MD_QUP1_SE4_I2C = sheet MODULE/MD_QUP1_SE4_I2C
harness MD_QUP1_SE4_I2C = sheet U_AUDIO_CODEC/I2C_1V8
harness MD_QUP1_SE4_I2C = sheet U_MIPI/HDMI_CONVERTER_I2C_1V8
harness MD_QUP1_SE4_I2C = sheet U_USB/PD_I2C1_1V8
harness MD_QUP1_SE4_I2C_3V3 = sheet U_PCIE/I2C_3V3
harness MD_QUP1_SE4_I2C_3V3 = sheet U_POWER/INA_I2C_3V3
harness MD_QUP2_SE0_SPI_3CS = sheet MODULE/MD_QUP2_SE0_SPI_3CS
harness MD_QUP2_SE0_SPI_3CS = sheet U_HEADERS_JMEDIA_JMISC/JMISC_SOC_SE_1V8
harness MD_SGMII0 = sheet MODULE/MD_SGMII0
harness MD_SGMII0 = sheet U_ETH/PHY_SGMII
harness MD_USB0_3.1 = sheet MODULE/MD_USB0_3.1
harness MD_USB0_3.1 = sheet U_USB/USBC_MUX_USB3
harness MD_USB1_2.0 = sheet MODULE/MD_USB1_2.0
harness MD_USB1_2.0 = sheet U_MICROCONTROLLER/USB_HS
harness MDI_LPI_I2S1 = sheet MODULE/MD_LPI_I2S1
harness MDI_LPI_I2S1 = sheet U_HEADERS_JHAT/I2S_1V8
harness MDI_LPI_I2S2 = sheet MODULE/MD_LPI_I2S2
harness MDI_LPI_I2S2 = sheet U_HEADERS_JMEDIA_JMISC/JMISC_SOC_MI2S_1V8
harness MDI_LPI_I2S3 = sheet MODULE/MD_LPI_I2S3
harness MDI_LPI_I2S3 = sheet U_PCIE/WIFI_I2S_1V8
harness MDI_LPI_I2S4 = sheet MODULE/MD_LPI_I2S4
harness MDI_LPI_I2S4 = sheet U_MIPI/HDMI_CONVERTER_I2S_1V8
harness MIC_IN5_IN6 = sheet U_AUDIO_CODEC/MIC_IN5_IN6
harness MIC_IN5_IN6 = sheet U_HEADERS_JALFA_JBETA/MIC
harness SAIL_JTAG = sheet MODULE/SAIL_JTAG
harness SAIL_JTAG = sheet U_HEADERS_JALFA_JBETA/JTAG_1V8
harness sheet U_AUDIO_CODEC/HEADPHONES_OUT = sheet U_HEADERS_JMEDIA_JMISC/JMISC_AUDIO_HEADPHONES_OUT
harness sheet U_AUDIO_CODEC/LINEOUT = sheet U_HEADERS_JMEDIA_JMISC/JMISC_AUDIO_LINEOUT
harness sheet U_AUDIO_CODEC/MIC_IN1_IN2 = sheet U_HEADERS_JMEDIA_JMISC/JMISC_AUDIO_MIC_IN
harness sheet U_CAN_PHY/CAN_3V3 = sheet U_MICROCONTROLLER/FDCAN1_MUX0_3V3
harness sheet U_CAN_PHY/CAN_PHY = sheet U_POWER/TERMINAL_CAN_PHY
harness sheet U_HEADERS_JALFA_JBETA/USB3.0_1 = sheet U_PCIE/USB1_DOWN
harness sheet U_HEADERS_JALFA_JBETA/USB3.0_2 = sheet U_PCIE/USB3_DOWN
harness sheet U_HEADERS_JMEDIA_JMISC/JMEDIA_SOC_CSI0 = sheet U_MIPI/MUX0_CSI_OUTA
harness sheet U_HEADERS_JMEDIA_JMISC/JMEDIA_SOC_CSI1 = sheet U_MIPI/MUX1_CSI_OUTA
harness sheet U_HEADERS_JMEDIA_JMISC/JMEDIA_SOC_DSI = sheet U_MIPI/MUX2_DSI_OUTA
harness sheet U_HEADERS_JMEDIA_JMISC/JMISC_MCU_I2C_3V3 = sheet U_MICROCONTROLLER/I2C2_3V3
harness sheet U_HEADERS_JMEDIA_JMISC/JMISC_MCU_PSSI_3V3 = sheet U_MICROCONTROLLER/PSSI_3V3
harness sheet U_HEADERS_UNO/JDIGITAL_MCU_I2C_3V3 = sheet U_MICROCONTROLLER/I2C4_3V3
harness sheet U_HEADERS_UNO/JDIGITAL_MCU_SPI_3V3 = sheet U_MICROCONTROLLER/SPI2_3V3
harness sheet U_HEADERS_UNO/JDIGITAL_MCU_UART_3V3 = sheet U_MICROCONTROLLER/UART3_3V3
harness sheet U_HEADERS_UNO/JSPI_MCU_SPI_3V3 = sheet U_MICROCONTROLLER/SPI3_NOCS_3V3
harness sheet U_PCIE/USB2_DOWN = sheet U_USB/USBA_USB3_UPPER
harness sheet U_PCIE/USB4_DOWN = sheet U_USB/USBA_USB3_LOWER
harness uC_FDCAN1_MUX1_3V3 = sheet U_HEADERS_JALFA_JBETA/CAN0_3V3
harness uC_FDCAN1_MUX1_3V3 = sheet U_MICROCONTROLLER/FDCAN1_MUX1_3V3
harness uC_FDCAN2_MUX1_3V3 = sheet U_HEADERS_JALFA_JBETA/CAN1_3V3
harness uC_FDCAN2_MUX1_3V3 = sheet U_MICROCONTROLLER/FDCAN2_MUX1_3V3
harness uC_FDCAN3_3V3 = sheet U_HEADERS_JALFA_JBETA/CAN2_3V3
harness uC_FDCAN3_3V3 = sheet U_MICROCONTROLLER/FDCAN3_3V3

### Layout directives
net class NET_I2C_SYSTEM_1V8: MD_GPIO_45, MD_GPIO_46
net class NET_I2C_SYSTEM_3V3: MD_QUP1_SE4_I2C_3V3.SCL, MD_QUP1_SE4_I2C_3V3.SDA

### Notes on the sheet
- Title:
- Reference Designs ARE PROVIDED "AS IS" AND "WITH ALL FAULTS. Arduino SA DISCLAIMS ALL OTHER WARRANTIES, EXPRESS OR IMPLIED, REGARDING PRODUCTS, INCLUDING BUT NOT LIMITED TO, ANY IMPLIED WARRANTIES OF MERCHANTABILITY OR FITNESS FOR A PARTICULAR PURPOSE.
  Arduino SA may make changes to specifications and product descriptions at any time, without notice. The Customer must not rely on the absence or characteristics of any features or instructions marked "reserved" or "undefined".
  Arduino SA reserves these for future definition and shall have no responsibility whatsoever for conflicts or incompatibilities arising from future changes to them. The product information on the Web Site or Materials is subject to change without notice.
  Do not finalize a design with this info. ARDUINO and other Arduino brands and logos and Trademarks of Arduino SA. All Arduino SA Trademarks cannot be used without owner's formal permission.
- ID:
- Date:
- File:
- Time:
- Version:
- Sheet
- Author:
- of
- RevAuthor:

### Library data of the parts
C333 = C0015-A.14: CAP CHIP 0402 100nF 10% 50V X5R; Manufacturer: Murata; Code Arduino: A5141; Part Number: GRM155R61H104KE19D; Dielectric: X5R; Tolerance: 10%; Technology: Ceramic
C338 = C0113-A.6: CAP CHIP 0201 100nF 10% 10V X5R; Manufacturer: Samsung Electro-Mechanics; Code Arduino: C0113; Technology: Ceramic; Part Number: CL03A104KP3NNNC; Dielectric: X5R; Tolerance: 10%
C346-C348 = C0002-A.15: CAP CHIP 0201 1uF 20% 6.3V X5R; Manufacturer: Murata; Code Arduino: A5520; Tolerance: 20%; Dielectric: X5R; Part Number: GRM033R60J105MEA2D; Technology: Ceramic
D44 = D0109-A.2: DIODE SCHOTTKY SMD 3A 40V SMA DO214AC; Manufacturer: Panjit; Part Number: SX34-AU_R1_000A1; Code Arduino: D0109; Forward Voltage: 0.39V; Device Type: Diode Schottky; Forward Current: 3A; Max Reverse Voltage (DC): 40V
Fiducial_1-Fiducial_6 = UT0024-A.6
Q7 = T0011-A.12: MOSFET 2N-CH 60V 0.32A SOT363; Manufacturer: Diodes Inc.; Device Type: Mosfet 2N-CH SMD; Code Arduino: A5500; Manufacturer 2: Nexperia; Manufacturer Part Number 2: 2N7002PS,115; Pin Count: 6; Part Number: 2N7002DW-7-F
R125 R174 R188 R216 R219 R346 R349 R350 R433 R477 R479 R482 R484 R485 R488 R510 = R0140-A.21: RES CHIP 0201 0R; Manufacturer: Vishay; Temperature coefficient: 0ppm; Code Arduino: R0140; Power: 50mW; Tolerance: 0%; Technology: Thick film; Case Code (Imperial): 0201; Part Number: CRCW02010000Z0ED
R155 R158-R160 R164 R175-R177 R487 = R0145-A.21: RES CHIP 0201 10k 1% 1/20W; Manufacturer: Yageo; Power: 50mW; Temperature coefficient: 200ppm; Code Arduino: R0145; Manufacturer 2: Samsung Electro-Mechanics; Tolerance: 1%; Case Code (Imperial): 0201; Part Number: RC0201FR-0710KL; Technology: Thick film
R250-R257 = R0195-A.22: RES CHIP 0201 1k 1% 1/20W; Manufacturer: Yageo; Power: 50mW; Temperature coefficient: 200ppm; Code Arduino: R0195; Tolerance: 1%; Case Code (Imperial): 0201; Part Number: RC0201FR-071KL; Technology: Thick film
R258 R478 = R0151-A.21: RES CHIP 0201 4k7 1% 1/20W; Manufacturer: Yageo; Power: 50mW; Temperature coefficient: 200ppm; Code Arduino: A5521; Tolerance: 1%; Case Code (Imperial): 0201; Part Number: RC0201FR-074K7L; Technology: Thick film
R483 = R0423-A.1: RES CHIP 0201 5.6M 1% 1/20W 200ppm; Manufacturer: YAGEO; Power: 50mW; Code Arduino: R0423; Tolerance: 1%; Temperature Coefficient: 200ppm; Case Code (Imperial): 0201; Part Number: RC0201FR-075M6L; Technology: Thick film
R511 = R0423-A.1: RES CHIP 0201 5.6M 1% 1/20W 200ppm; Manufacturer: YAGEO; Code Arduino: R0423; Power: 50mW; Part Number: RC0201FR-075M6L; Temperature Coefficient: 200ppm; Tolerance: 1%; Case Code (Imperial): 0201; Technology: Thick film
TP40-TP42 = UT0013-A.6: Part Number: This is not a component; Design Item ID: CMP-018-0005-A.3; Source: ut.SchLib; Manufacturer: This is not a component; Code Arduino: This is not a component; Pin Count: 1
U25 = U0494-A.2: IC buffer open drain, 1.65V to 5.5V, 32mA sink current, SOT-5X3 1.6mmx1.6mm; Manufacturer: Texas Instruments; Code Arduino: U0494; Part Number: SN74LVC1G07DRLR